# Altium project RobotComputerVision_1.1.PrjPcb
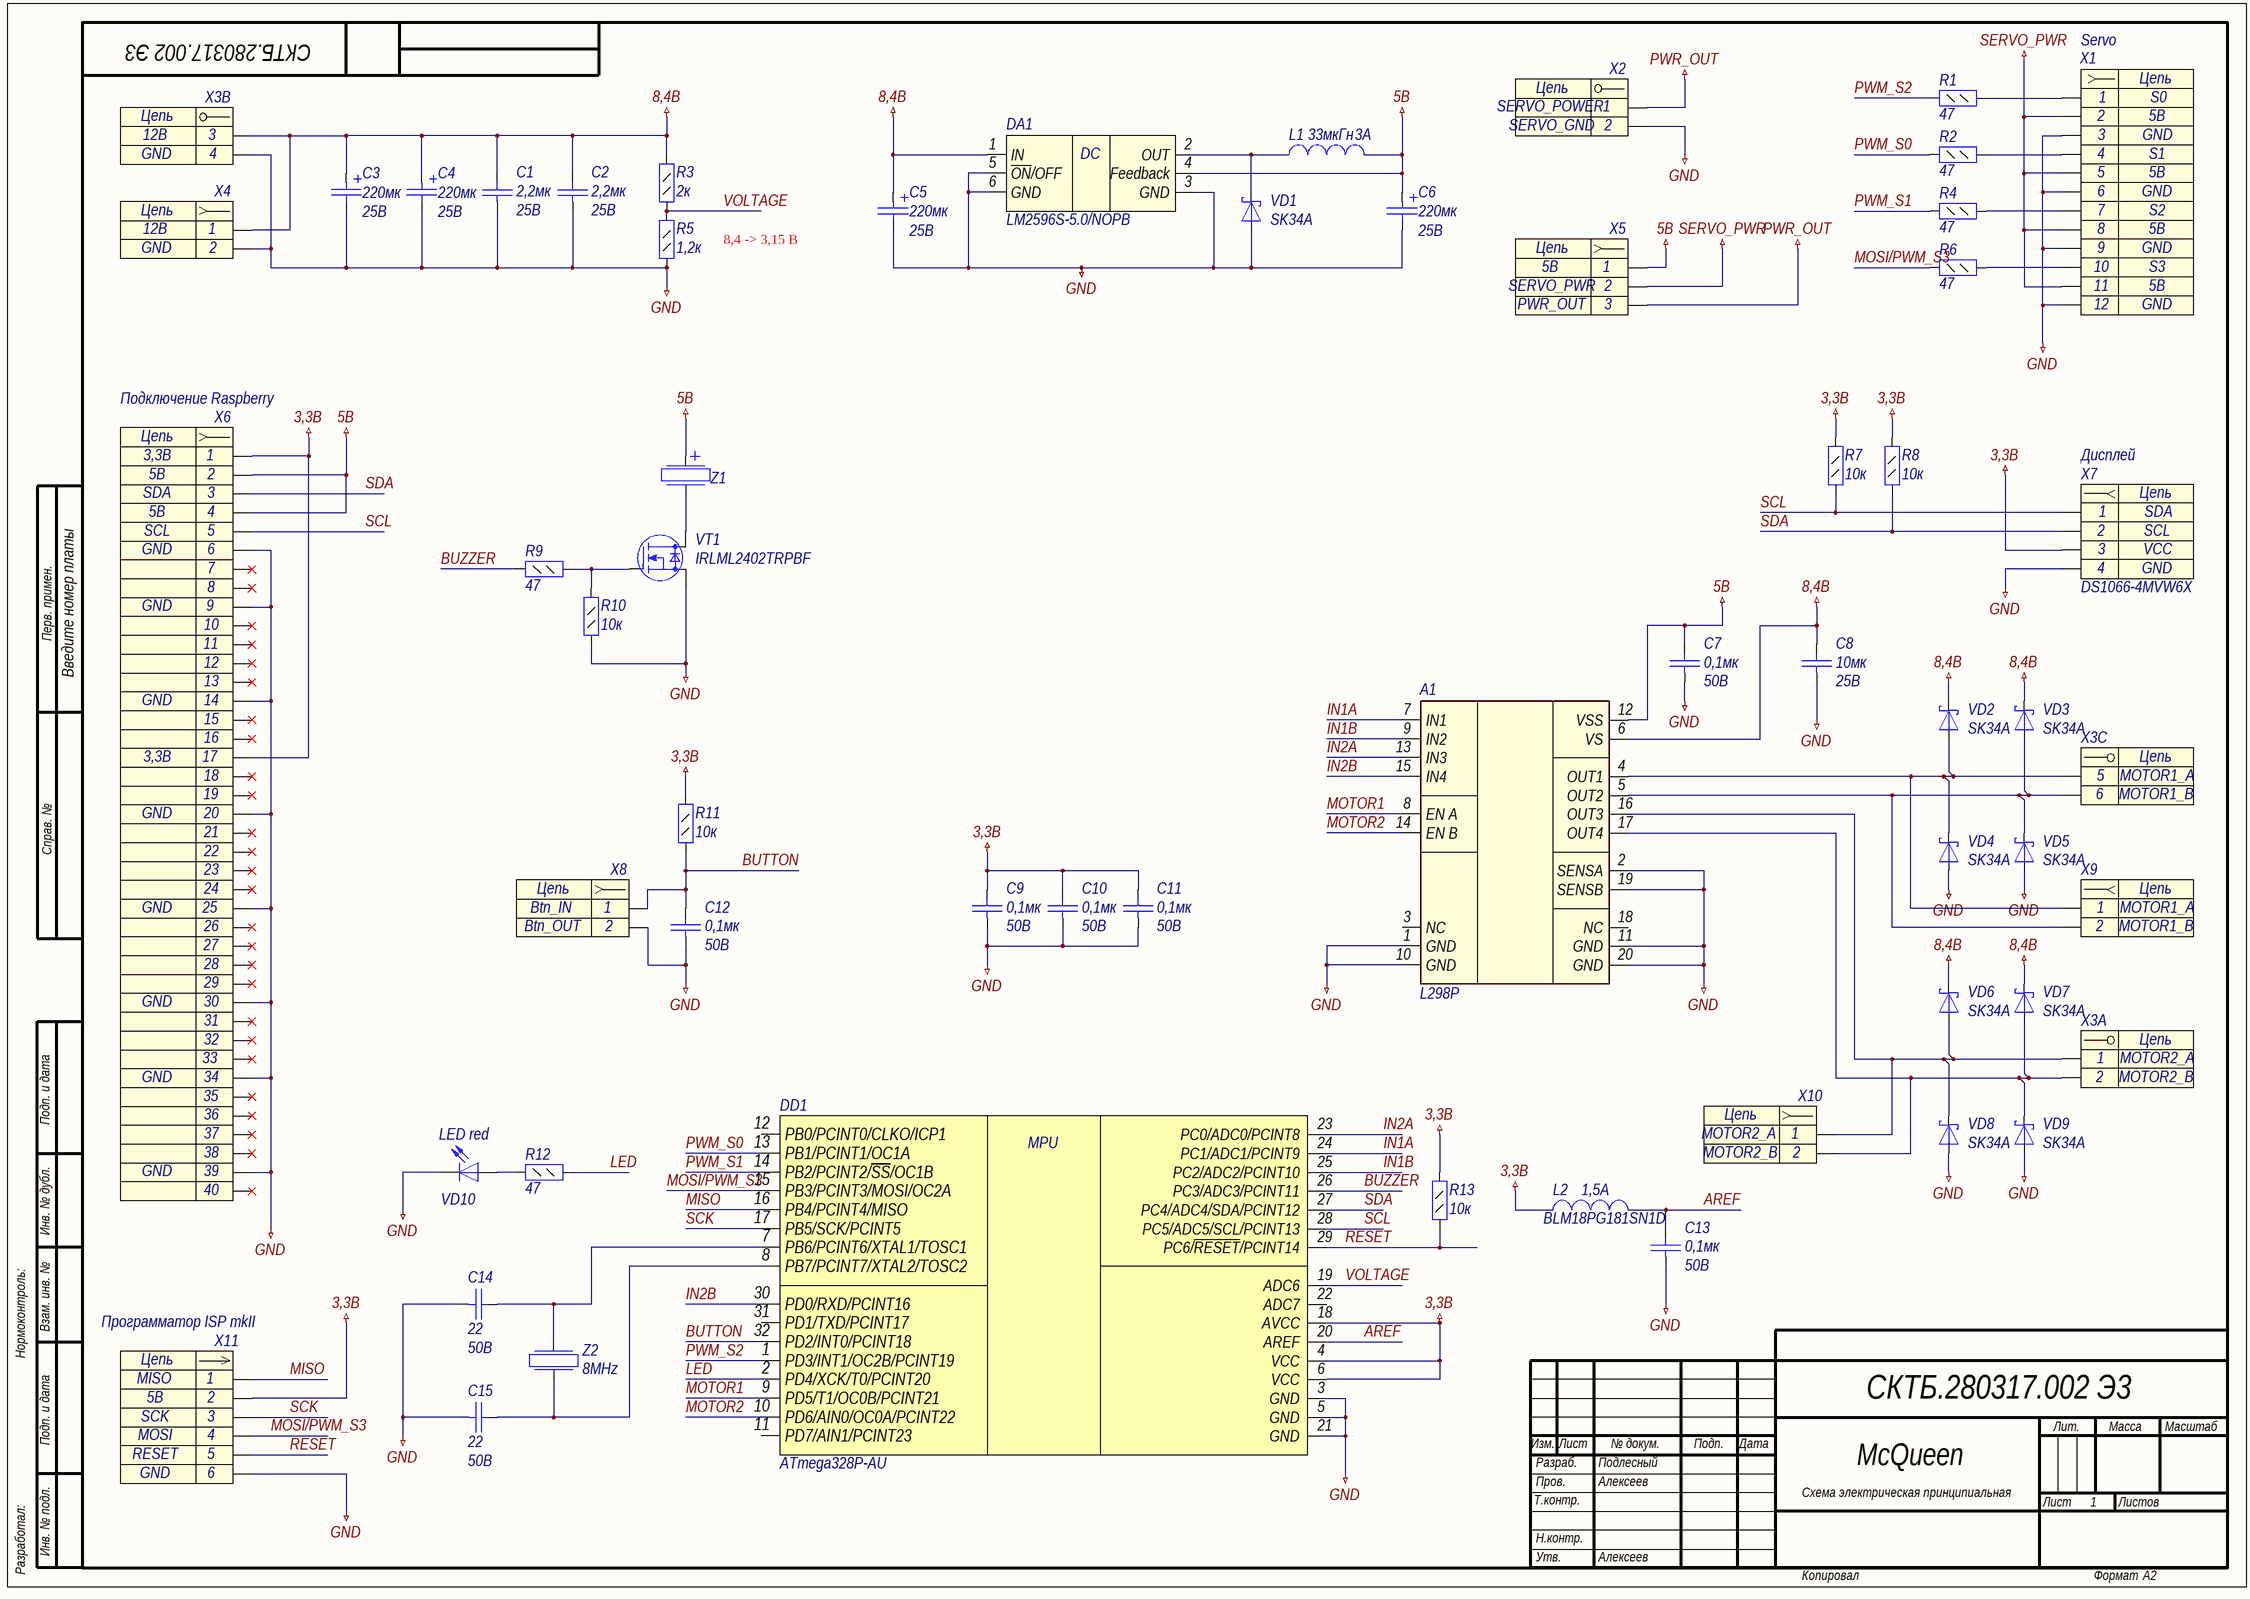
[diagram p0: RobotComputerVision_1.1.SchDoc]
1 sheet, 57 parts. Net scope: global (net labels, ports and power ports of the same name join across sheets).
Board file: RobotComputerVision_1.1.PcbDoc

## Sheet RobotComputerVision_1.1.SchDoc: Kapitoshka
size 594 x 420 mm; ApprovedBy: Алексеев; CheckedBy: Алексеев; DrawnBy: Подлесный; DocumentNumber: СКТБ.280317.002 Э3; SheetNumber: 1; Format: A2; DocumentType: Схема электрическая принципиальная; ImagePath: Введите номер платы

### Parts
A1  L298P  [POWERSO20]
C1  Voltage: 25B  [C0805]  (hidden comment: 2,2мк)
C2  Voltage: 25B  [C0805]  (hidden comment: 2,2мк)
C3  value 220мк  Voltage: 25В  [Cap_SMD_radial_polar(8x10.2)]  (hidden comment: Capacitor_pol)
C4  value 220мк  Voltage: 25В  [Cap_SMD_radial_polar(8x10.2)]  (hidden comment: Capacitor_pol)
C5  value 220мк  Voltage: 25В  [Cap_SMD_radial_polar(8x10.2)]  (hidden comment: Capacitor_pol)
C6  value 220мк  Voltage: 25В  [Cap_SMD_radial_polar(8x10.2)]  (hidden comment: Capacitor_pol)
C7  Voltage: 50В  [C0805]  (hidden comment: 0,1мк)
C8  Voltage: 25В  [C1210]  (hidden comment: 10мк)
C9  Voltage: 50В  [C0805]  (hidden comment: 0,1мк)
C10  Voltage: 50В  [C0805]  (hidden comment: 0,1мк)
C11  Voltage: 50В  [C0805]  (hidden comment: 0,1мк)
C12  Voltage: 50В  [C0805]  (hidden comment: 0,1мк)
C13  Voltage: 50В  [C0805]  (hidden comment: 0,1мк)
C14  Voltage: 50В  [C0805]  (hidden comment: 22)
C15  Voltage: 50В  [C0805]  (hidden comment: 22)
DA1  Part Number: LM2596S-5.0/NOPB  [TO-263-5]  (hidden comment: LM2596S)
DD1  ATmega328P-AU  [TQFP-32]
L1  value 33мкГн  Rated Current: 3A  [IND_12.5x12.5]  (hidden comment: Inductor)
L2  Rated Current: 1,5A  Part Number: BLM18PG181SN1D  [L0603]  (hidden comment: Inductor)
R1  value 47  [R0805]  (hidden comment: Resistor_0,125Вт)
R2  value 47  [R0805]  (hidden comment: Resistor_0,125Вт)
R3  value 2к  [R0805]  (hidden comment: Resistor_0,125Вт)
R4  value 47  [R0805]  (hidden comment: Resistor_0,125Вт)
R5  value 1,2к  [R0805]  (hidden comment: Resistor_0,125Вт)
R6  value 47  [R0805]  (hidden comment: Resistor_0,125Вт)
R7  value 10к  [R0805]  (hidden comment: Resistor_0,125Вт)
R8  value 10к  [R0805]  (hidden comment: Resistor_0,125Вт)
R9  value 47  [R0805]  (hidden comment: Resistor_0,125Вт)
R10  value 10к  [R0805]  (hidden comment: Resistor_0,125Вт)
R11  value 10к  [R0805]  (hidden comment: Resistor_0,125Вт)
R12  value 47  [R0805]  (hidden comment: Resistor_0,125Вт)
R13  value 10к  [R0805]  (hidden comment: Resistor_0,125Вт)
VD1  Part Number: SK34A  [SMA]  (hidden comment: DiodeSchottky)
VD2  Part Number: SK34A  [SMA]  (hidden comment: DiodeSchottky)
VD3  Part Number: SK34A  [SMA]  (hidden comment: DiodeSchottky)
VD4  Part Number: SK34A  [SMA]  (hidden comment: DiodeSchottky)
VD5  Part Number: SK34A  [SMA]  (hidden comment: DiodeSchottky)
VD6  Part Number: SK34A  [SMA]  (hidden comment: DiodeSchottky)
VD7  Part Number: SK34A  [SMA]  (hidden comment: DiodeSchottky)
VD8  Part Number: SK34A  [SMA]  (hidden comment: DiodeSchottky)
VD9  Part Number: SK34A  [SMA]  (hidden comment: DiodeSchottky)
VD10  Part Name: LED red  [L_0805]  (hidden comment: LED)
VT1  Part Number: IRLML2402TRPBF  [SOT23-3]  (hidden comment: N-MOSFET)
X1  Servo  [PLS-12]
X2  Header_2_trm  [TERMINAL-2WAY-3.5MM]  (value not drawn)
X3  (no value)  [TERMINAL-6WAY-5MM]  (parts A,B,C of 3)
X4  Header_2_sct  [2HOLE_2.5]  (value not drawn)
X5  Header_3_sct  [TAB_3PAD]  (value not drawn)
X6  Подключение Raspberry  [PBS-40]
X7  Дисплей  Part Number: DS1066-4MVW6X  [MW-4M]
X8  Header_2_sct  [2HOLE_2.5]  (value not drawn)
X9  Header_2_sct  [2HOLE_2.5]  (value not drawn)
X10  Header_2_sct  [2HOLE_2.5]  (value not drawn)
X11  Программатор ISP mkII  [PLS2-6]
Z1  (no value)  [Buzzer_gen_12mm]
Z2  Frequence: 8MHz  [QSMD5.0x3.2x1.0]  (hidden comment: Crystal)

### Nets
3,3B: C9.2 C10.2 C11.2 DD1.4(VCC) DD1.6(VCC) DD1.18(AVCC) L2.1 R7.2 R8.2 R11.2 R13.2 X6.1 X6.17 X7.3 X11.2
5В: A1.12(VSS) C6.1 C7.2 DA1.4(Feedback) L1.2 X5.1 X6.2 X6.4 Z1.1
8,4В: A1.6(VS) C1.2 C2.2 C3.1 C4.1 C5.1 C8.2 DA1.1(IN) R3.2 VD2.1(K) VD3.1(K) VD6.1(K) VD7.1(K) X3.3 X4.1
GND: A1.1(GND) A1.2(SENSA) A1.10(GND) A1.11(GND) A1.19(SENSB) A1.20(GND) C1.1 C2.1 C3.2 C4.2 C5.2 C6.2 C7.1 C8.1 C9.1 C10.1 C11.1 C12.1 C13.1 C14.1 C15.1 DA1.3(GND) DA1.5(~{ON}/OFF) DA1.6(GND) DD1.3(GND) DD1.5(GND) DD1.21(GND) R5.1 R10.1 VD1.2(A) VD4.2(A) VD5.2(A) VD8.2(A) VD9.2(A) VD10.1(K) VT1.3(S) X1.3 X1.6 X1.9 X1.12 X2.2 X3.4 X4.2 X6.6 X6.9 X6.14 X6.20 X6.25 X6.30 X6.34 X6.39 X7.4 X8.2 X11.6
PWR_OUT: X2.1 X5.3
SERVO_PWR: X1.2 X1.5 X1.8 X1.11 X5.2
AREF: C13.2 DD1.20(AREF) L2.2
BUTTON: C12.2 DD1.32(PD2/INT0/PCINT18) R11.1 X8.1
BUZZER: DD1.26(PC3/ADC3/PCINT11) R9.1
IN1A: A1.7(IN1) DD1.24(PC1/ADC1/PCINT9)
IN1B: A1.9(IN2) DD1.25(PC2/ADC2/PCINT10)
IN2A: A1.13(IN3) DD1.23(PC0/ADC0/PCINT8)
IN2B: A1.15(IN4) DD1.30(PD0/RXD/PCINT16)
LED: DD1.2(PD4/XCK/T0/PCINT20) R12.2
MISO: DD1.16(PB4/PCINT4/MISO) X11.1
MOSI/PWM_S3: DD1.15(PB3/PCINT3/MOSI/OC2A) R6.1 X11.4
MOTOR1: A1.8(EN_A) DD1.9(PD5/T1/OC0B/PCINT21)
MOTOR2: A1.14(EN_B) DD1.10(PD6/AIN0/OC0A/PCINT22)
PWM_S0: DD1.13(PB1/PCINT1/OC1A) R2.1
PWM_S1: DD1.14(PB2/PCINT2/~{SS}/OC1B) R4.1
PWM_S2: DD1.1(PD3/INT1/OC2B/PCINT19) R1.1
RESET: DD1.29(PC6/~{RESET}/PCINT14) R13.1 X11.5
SCK: DD1.17(PB5/SCK/PCINT5) X11.3
SCL: DD1.28(PC5/ADC5/SCL/PCINT13) R7.1 X6.5 X7.1
SDA: DD1.27(PC4/ADC4/SDA/PCINT12) R8.1 X6.3 X7.2
VOLTAGE: DD1.19(ADC6) R3.1 R5.2
NetA1_4: A1.4(OUT1) VD2.2(A) VD4.1(K) X3.5 X9.1
NetA1_5: A1.5(OUT2) VD3.2(A) VD5.1(K) X3.6 X9.2
NetA1_16: A1.16(OUT3) VD6.2(A) VD8.1(K) X3.1 X10.1
NetA1_17: A1.17(OUT4) VD7.2(A) VD9.1(K) X3.2 X10.2
NetC14_2: C14.2 DD1.7(PB6/PCINT6/XTAL1/TOSC1) Z2.2
NetC15_2: C15.2 DD1.8(PB7/PCINT7/XTAL2/TOSC2) Z2.1
NetDA1_2: DA1.2(OUT) L1.1 VD1.1(K)
NetR1_2: R1.2 X1.1
NetR2_2: R2.2 X1.4
NetR4_2: R4.2 X1.7
NetR6_2: R6.2 X1.10
NetR9_2: R9.2 R10.2 VT1.1(G)
NetR12_1: R12.1 VD10.2(A)
NetVT1_2: VT1.2(D) Z1.2

Not connected (* = marked no-connect by the designer): A1 3(NC) 18(NC); DD1 11(PD7/AIN1/PCINT23) 12(PB0/PCINT0/CLKO/ICP1) 22(ADC7) 31(PD1/TXD/PCINT17); X6 7* 8* 10* 11* 12* 13* 15* 16* 18* 19* 21* 22* 23* 24* 26* 27* 28* 29* 31* 32* 33* 35* 36* 37* 38* 40*

### Notes on the sheet
- 8,4 -> 3,15 B
- Перв. примен.
- Справ. №
- Подп. и дата
- Инв. № дубл.
- Нормоконтроль:
- Взам. инв. №
- Изм.
- Лист
- № докум.
- Подп.
- Дата
- Лит.
- Масса
- Масштаб
- Т.контр.
- Пров.
- Разраб.
- McQueen
- Листов
- Разработал:
- Инв. № подл.
- Н.контр.
- Утв.
- Копировал
- Формат
- (in symbol connect9) Цепь
- (in symbol connect11, part A) Цепь
- (in symbol connect11, part B) Цепь
- (in symbol connect11, part C) Цепь
- (in symbol connect29) Цепь
- (in symbol connect34) Цепь
- (in symbol connect41) Цепь
- (in symbol connect80) Цепь
- (in symbol connect135) Цепь
- (in symbol connect138) Цепь
- (in symbol microcont1) MPU
- (in symbol pwr3) DC

### Library data of the parts
A1 = driver1: FULL BRIDGE DC MOTOR DRIVER; Logic High: 4,5-5-7B; Max Operating Supply Voltage: 46B; Maximum output current: 2A; Maximum Power Dissipation: 25W; id: driver1; Part Name: Motor Driver; Part Number: L298P
C1 C2 = cap152: Конденсатор; Part Name: Ceramic; Manufacture: Murata; Part Number: GRM21BR71E225K; id: cap152; TKE: X7R; Value: 2,2мк
C3-C6 = cap320: Конденсатор полярный; Part Name: Electrolit; Manufacture: JB; Part Number: JCK1E221M080105; id: cap320
C7 C9-C13 = cap160: Конденсатор; Part Name: Ceramic; Manufacture: Murata; Part Number: GRM21BR71H104KA01L; id: cap160; TKE: X7R; Value: 0,1мк
C8 = cap193: Конденсатор; Part Name: Ceramic; Manufacture: Murata; Part Number: GRM32ER61A106K; id: cap193; TKE: X7R; Value: 10мк
C14 C15 = cap321: Конденсатор; Part Name: Ceramic; Manufacture: Тайвань; Part Number: MLCC22pFNPO50V5%0805; id: cap321; Value: 22
DA1 = pwr3: 3-A Step-Down Voltage Regulator; Part Name: 3A Step-Down Voltage Regulator; Manufacturer: Texas Instruments; id: pwr3; Input Voltage: 40B; Output Voltage: 5B; Current: 3A; Type: Impulse
DD1 = microcont1: Микроконтроллер 8-Бит, picoPower, AVR, 20МГц, 32КБ Flash; Part Name: Microcontroller; Frequency: 20MHz; ADC: 8x10b; Interface: i2c, spi, uart; Flash: 32kb; Pin in: 23; Power Supply: 1.8-5.5 V; id: microcont1; Part Number: ATmega328P-AU
L1 = ind80: EMI Suppression Filter; Part Name: SMD Power Inductors; Part Number: B82477G4333M000; Manufacture: Epcos; id: ind80; Saturation Current: 3,5A; Resistance: 0,053Ohm
L2 = ind0: EMI Suppression Filter; Part Name: EMI Suppression Filters; id: ind0; Resistance: 0,09Ohm
R1 R2 R4 R6 R9 R12 = res41: Резистор; Manufacture: Yageo; Part Number: RC0805FR-0747RL; id: res41; Accuracy: 0,01; Part Name: Resistor; Power: 0,125Вт
R3 = res84: Резистор; Manufacture: Yageo; Part Number: RC0805FR-072KL; id: res84; Accuracy: 0,01; Part Name: Resistor; Power: 0,125Вт
R5 = res78: Резистор; Manufacture: Yageo; Part Number: RC0805FR-071K2; id: res78; Accuracy: 0,01; Part Name: Resistor; Power: 0,125Вт
R7 R8 R10 R11 R13 = res101: Резистор; Manufacture: Yageo; Part Number: RC0805FR-0710KL; id: res101; Accuracy: 0,01; Part Name: Resistor; Power: 0,125Вт
VD1-VD9 = diode1: Диод Шоттки; Manufacture: Taiwan Semiconductor; id: diode1; Max Reverse Voltage: 40B; Forward Voltage: 0,55B; Forward Current: 3A; Part Name: Diode Schottky
VD10 = diode5: Светодиод; Part Number: KP-2012EC; Manufacture: Kingbright; id: diode5
VT1 = mosfert2: Manufacturer: International Rectifier; Structure: n-channel; V drain-source max: 20B; Rds: 0,25Ohm; Gate-to-source voltage: (+-)12B; Continuous drain current: 1,2A; Total gate charge: 2,6nC; Pulsed drain current: 7,4A; Power dissipation: 0,54W; id: mosfert2
X1 = connect135: Разъем - 12 конт. розетка; Part Name: PLS-3 4way; Contact_1: S0; Contact_2: 5B; Contact_3: GND; Contact_4: S1; Etch: 2.54mm; Contact_7: S2; Contact_10: S3; Contact_5: 5B; Contact_6: GND; id: connect135; Contact_8: 5B; Contact_9: GND; Contact_11: 5B; Contact_12: GND
X2 = connect34: Разъем - 2 конт. клеммник; Part Name: TERMINAL BLOCK 2 way; Contact_1: SERVO_POWER; Contact_2: SERVO_GND; Etch: 3.5mm; id: connect34
X3 = connect11: POWER; Part Name: TERMINAL BLOCK 6 way; Contact_2: MOTOR2_B; Contact_1: MOTOR2_A; Etch: 5mm; Contact_5: Contact_5; Contact_6: Contact_6; Contact_4: Contact_4; Contact_3: Contact_3; id: connect11
X4 = connect9: Разъем - 2 конт. розетка; Part Name: Hole for connector; Contact_1: 12B; Contact_2: GND; id: connect9
X5 = connect138: Разъем - 3 конт. розетка; Part Name: Таб переключатель 3 контактный; Contact_1: 5B; Contact_2: SERVO_PWR; Contact_3: PWR_OUT; Etch: 1mm; id: connect138
X6 = connect29: Разъем - 5 конт. розетка; Manufacture: Ningbo connfly electronic; Contact_1: 3,3B; Contact_2: 5B; Contact_3: SDA; Contact_5: SCL; Contact_6: GND; Etch: 2,54mm; Part Name: PBS-40; Contact_4: 5B; id: connect29; Contact_9: GND; Contact_14: GND; Contact_17: 3,3B; Contact_20: GND; Contact_25: GND; Contact_30: GND; Contact_34: GND; Contact_39: GND
X7 = connect80: Разъем - 4 конт. розетка; Part Name: Вилка на плату прямая 2мм 4pin; Manufacture: Ningbo connfly electronic; Contact_1: SDA; Contact_2: SCL; Contact_3: VCC; Contact_4: GND; Etch: 2mm; id: connect80
X8 = connect9: Разъем - 2 конт. розетка; Part Name: Hole for connector; Contact_1: Btn_IN; Contact_2: Btn_OUT; id: connect9
X9 = connect9: Разъем - 2 конт. розетка; Part Name: Hole for connector; Contact_1: MOTOR1_A; Contact_2: MOTOR1_B; id: connect9
X10 = connect9: Разъем - 2 конт. розетка; Part Name: Hole for connector; Contact_1: MOTOR2_A; Contact_2: MOTOR2_B; id: connect9
X11 = connect41: Разъем - 6 конт. вилка; Contact_1: MISO; Contact_2: 5B; Contact_3: SCK; Contact_4: MOSI; Contact_5: RESET; Contact_6: GND; Part Name: MKII; id: connect41
Z1 = buzzer1: Пьезоизлучатель звуковой без генератора; Part Number: HCM1212X; Frequence: 2300Hz; Generator: yes; Intensity: 85dB; Supply Voltage: 12B; Max  Current: 30mA; id: buzzer1
Z2 = crystal0: Кварцевый резонатор; Manufacture: GEYER; Part Number: KX-9A; id: crystal0